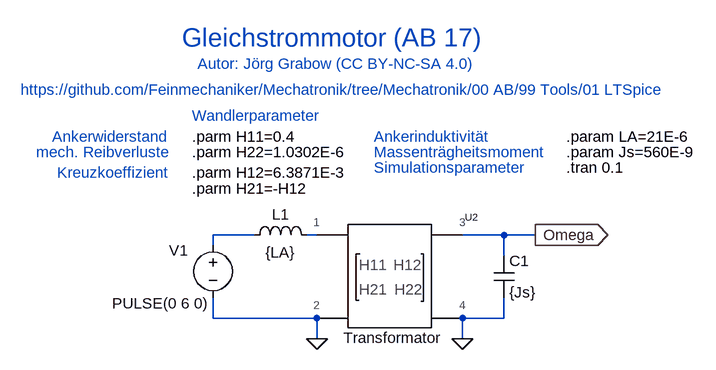
[diagram p0: schematic LAB_17.asc]
LAB_17.asc, the LTspice schematic file:
Version 4
SHEET 1 1232 680
WIRE 16 0 -48 0
WIRE 112 0 96 0
WIRE 400 0 336 0
WIRE 448 0 400 0
WIRE -48 16 -48 0
WIRE 400 32 400 0
WIRE -48 128 -48 96
WIRE 112 128 -48 128
WIRE 400 128 400 96
WIRE 400 128 336 128
WIRE 112 160 112 128
WIRE 336 160 336 128
FLAG 112 160 0
FLAG 336 160 0
FLAG 448 0 Omega
IOPIN 448 0 Out
SYMBOL voltage -48 0 R0
WINDOW 123 0 0 Left 2
WINDOW 39 24 132 Left 2
WINDOW 0 -68 24 Left 2
WINDOW 3 -155 105 Left 2
SYMATTR InstName V1
SYMATTR Value PULSE(0 6 0)
SYMBOL ind 0 16 R270
WINDOW 0 32 56 VTop 2
WINDOW 3 5 56 VBottom 2
SYMATTR InstName L1
SYMATTR Value {LA}
SYMBOL cap 384 32 R0
SYMATTR InstName C1
SYMATTR Value {Js}
SYMBOL Mechatronik\\Wandler\\Transformator 224 48 R0
SYMATTR InstName U2
SYMATTR Value H11={H11}
SYMATTR Value2 H12={H12}
SYMATTR SpiceLine H21={H21}
SYMATTR SpiceLine2 H22={H22}
TEXT -80 -72 Left 2 !.parm H21=-H12
TEXT -80 -96 Left 2 !.parm H12=6.3871E-3
TEXT -80 -152 Left 2 !.parm H11=0.4
TEXT 496 -104 Left 2 !.tran 0.1
TEXT -80 -128 Left 2 !.parm H22=1.0302E-6
TEXT -80 -184 Left 2 ;Wandlerparameter
TEXT 200 -104 Left 2 ;Simulationsparameter
TEXT -96 -304 Left 4 ;Gleichstrommotor (AB 17)
TEXT -344 -224 Left 2 ;https://github.com/Feinmechaniker/Mechatronik/tree/Mechatronik/00 AB/99 Tools/01 LTSpice
TEXT -72 -264 Left 2 ;Autor: Jörg Grabow (CC BY-NC-SA 4.0)
TEXT -296 -152 Left 2 ;Ankerwiderstand
TEXT -320 -128 Left 2 ;mech. Reibverluste
TEXT -288 -96 Left 2 ;Kreuzkoeffizient
TEXT 200 -152 Left 2 ;Ankerinduktivität
TEXT 200 -128 Left 2 ;Massenträgheitsmoment
TEXT 496 -128 Left 2 !.param Js=560E-9
TEXT 496 -152 Left 2 !.param LA=21E-6

The netlist it stands for:
* LAB_17.asc
V1 N001 0 PULSE(0 6 0)
L1 N001 N002 {LA}
C1 Omega 0 {Js}
XU2 N002 0 Omega 0 Transformator H11={H11} H12={H12} H21={H21} H22={H22}  ; pins 1 2 3 4
.parm H21=-H12
.parm H12=6.3871E-3
.parm H11=0.4
.tran 0.1
.parm H22=1.0302E-6
* Wandlerparameter
* Simulationsparameter
* Gleichstrommotor (AB 17)
* https://github.com/Feinmechaniker/Mechatronik/tree/Mechatronik/00 AB/99 Tools/01 LTSpice
* Autor: Jörg Grabow (CC BY-NC-SA 4.0)
* Ankerwiderstand
* mech. Reibverluste
* Kreuzkoeffizient
* Ankerinduktivität
* Massenträgheitsmoment
.param Js=560E-9
.param LA=21E-6
.lib Mechatronik.lib
.backanno
.end